# EAGLE design 2in-2out_1.0d (EAGLE 5.02)
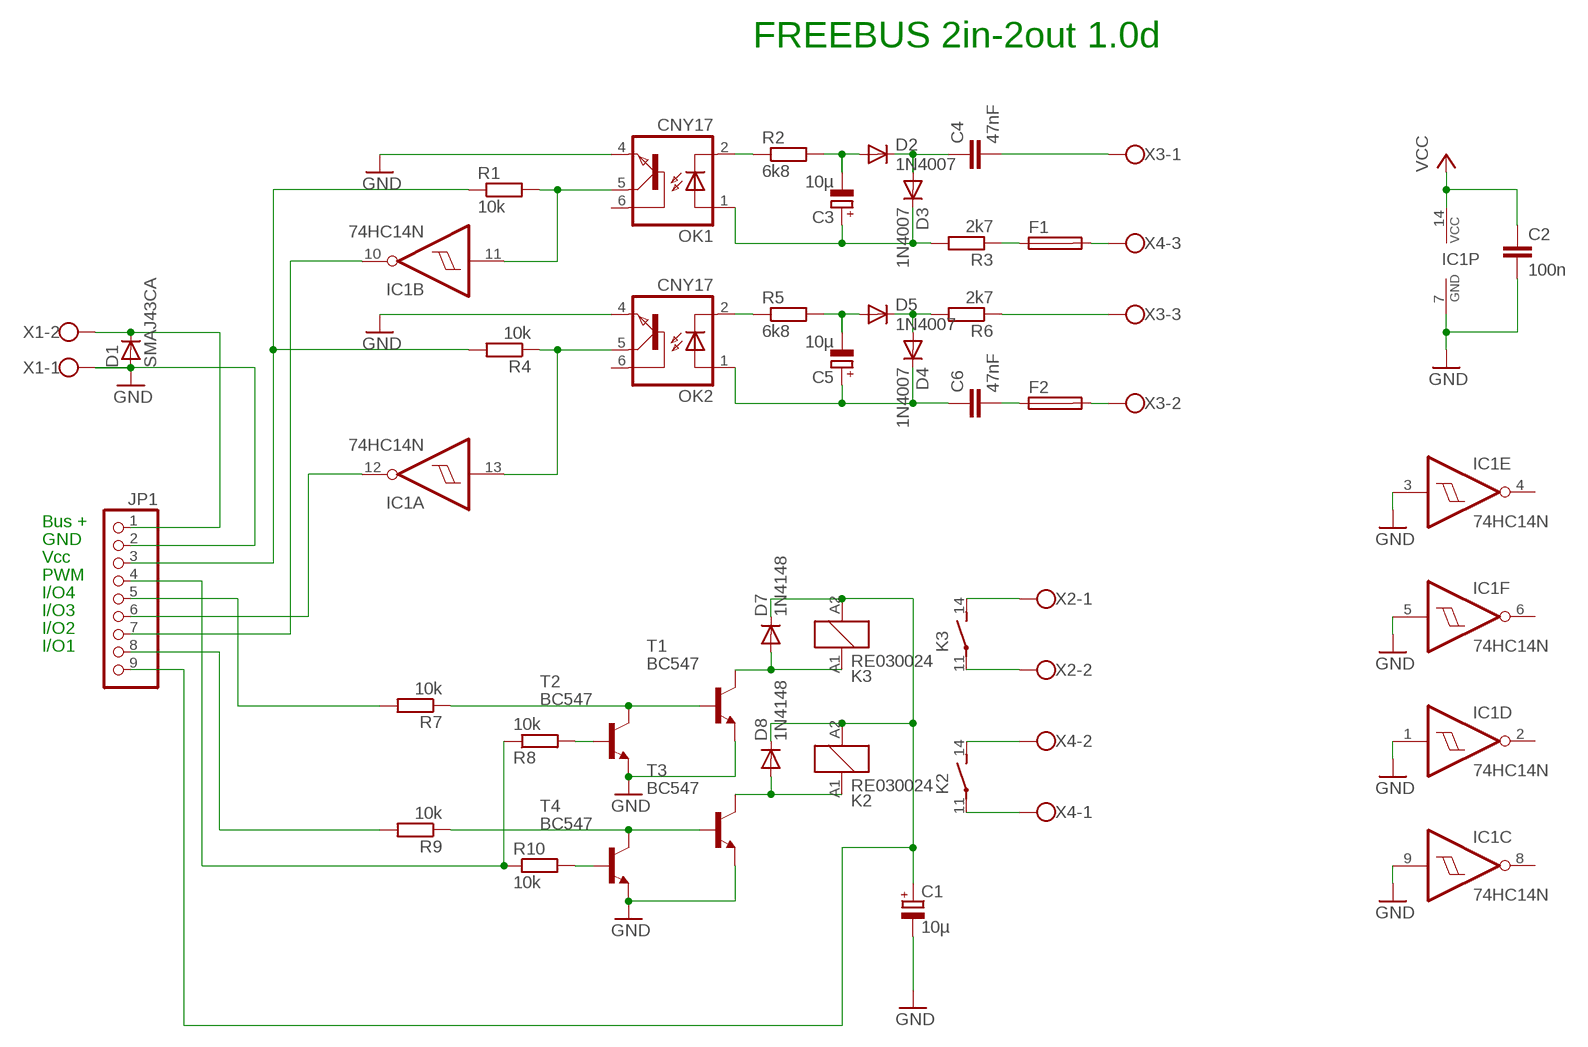
[diagram p0: schematic, sheet 1]

## Parts
C1  10µ  CPOL-EUE3.5-8  [E3,5-8]
C2  100n  C-EU025-024X044  [C025-024X044]
C3  10µ  CPOL-EUE2-4  [E2-4]
C4  47nF  C-EU075-063X106  [C075-063X106]
C5  10µ  CPOL-EUE2-4  [E2-4]
C6  47nF  C-EU075-063X106  [C075-063X106]
D1  SMAJ43CA  D-SMB  [SMB]
D2  1N4007  DIODE-D-2.5  [D-2.5]
D3  1N4007  DIODE-D-2.5  [D-2.5]
D4  1N4007  DIODE-D-2.5  [D-2.5]
D5  1N4007  DIODE-D-2.5  [D-2.5]
D7  1N4148  1N4148STEHEND  [D-2.5]
D8  1N4148  1N4148STEHEND  [D-2.5]
F1  TR5  [TR5]
F2  TR5  [TR5]
IC1  74HC14N  [DIL14]
JP1  PINHD-1X9  [1X09]
K2  RE030024  [RE-SCHRACK]
K3  RE030024  [RE-SCHRACK]
OK1  CNY17  [DIL06]
OK2  CNY17  [DIL06]
R1  10k  R-EU_0207/2V  [0207/2V]
R2  6k8  R-EU_0207/2V  [0207/2V]
R3  2k7  R-EU_0207/2V  [0207/2V]
R4  10k  R-EU_0207/2V  [0207/2V]
R5  6k8  R-EU_0207/2V  [0207/2V]
R6  2k7  R-EU_0207/2V  [0207/2V]
R7  10k  R-EU_0207/2V  [0207/2V]
R8  10k  R-EU_0207/2V  [0207/2V]
R9  10k  R-EU_0207/7  [0207/7]
R10  10k  R-EU_0207/7  [0207/7]
T1  BC547  [TO92]
T2  BC547  [TO92]
T3  BC547  [TO92]
T4  BC547  [TO92]
X1  W237-02P  [W237-132]
X2  W237-02P  [W237-132]
X3  W237-3E  [W237-3E]
X4  W237-3E  [W237-3E]

## Nets
GND: C1.- C2.2 D1.2(A) IC1.1(D:I) IC1.3(E:I) IC1.5(F:I) IC1.7(P:GND) IC1.9(C:I) JP1.2 OK1.4(EMI) OK2.4(EMI) T1.1(E) T2.1(E) T3.1(E) T4.1(E) X1.1
IO1: JP1.8 R9.2
IO2: IC1.10(B:O) JP1.7
IO3: IC1.12(A:O) JP1.6
IO4: JP1.5 R7.2
N$1: OK1.2(C) R2.1
N$2: K3.11(2:P) X2.2
N$3: C3.- D2.A R2.2
N$4: D1.1(C) JP1.1 X1.2
N$5: C4.1 D2.C D3.A
N$6: K3.14(2:S) X2.1
N$7: F1.1 R3.1
N$8: K2.14(2:S) X4.2
N$9: K2.11(2:P) X4.1
N$10: OK2.2(C) R5.1
N$11: R6.1 X3.3
N$12: C4.2 X3.1
N$13: C5.- D5.A R5.2
N$14: R7.1 T1.2(B) T2.3(C)
N$15: F1.2 X4.3
N$17: R9.1 T3.2(B) T4.3(C)
N$18: D4.A D5.C R6.2
N$19: D8.A K2.A1 T3.3(C)
N$20: C5.+ C6.1 D4.C OK2.1(A)
N$21: R8.2 T2.2(B)
N$22: R10.2 T4.2(B)
N$23: C6.2 F2.1
N$24: C3.+ D3.C OK1.1(A) R3.2
N$25: F2.2 X3.2
N$28: IC1.13(A:I) OK2.5(COL) R4.1
N$29: IC1.11(B:I) OK1.5(COL) R1.2
PWM: JP1.4 R8.1 R10.1
R3: D7.A K3.A1 T1.3(C)
VCC: C2.1 IC1.14(P:VCC) JP1.3 R1.1 R4.2
VDD_IN: C1.+ D7.C D8.C JP1.9 K2.A2 K3.A2
Unconnected: IC1.2(D:O) IC1.4(E:O) IC1.6(F:O) IC1.8(C:O) OK1.6(BAS) OK2.6(BAS)

## Notes on the sheet
- FREEBUS 2in-2out 1.0d
- Bus +
- GND
- Vcc
- PWM
- I/O4
- I/O3
- I/O2
- I/O1

## Library data of the parts
C1 C3 C5 = rcl:CPOL-EU: POLARIZED CAPACITOR, European symbol
C2 C4 C6 = rcl:C-EU: CAPACITOR, European symbol
D1 = semicon-smd-ipc:D-: DIODE unfilled
D2-D5 = diode:DIODE-: DIODE
D7 D8 = diode:1N4148: DIODE high speed (Philips)
F1 F2 = fuse:TR5: FUSE Wickmann
IC1 = 74xx-eu:74*14: Hex schmitt trigger INVERTER
JP1 = pinhead:PINHD-1X9: PIN HEADER
K2 K3 = relay:RE03*: Miniature PCB Relay 1 pole 6 A SCHRACK Source: http://www.schrack.com/.. 5812.pdf
OK1 OK2 = optocoupler:CNY17: SIEMENS OPTO COUPLER
R1-R10 = rcl:R-EU_: RESISTOR, European symbol
T1-T4 = transistor-npn:BC547*: NPN Transistor
X1 X2 = con-wago-508:W237-02P: WAGO SREW CLAMP
X3 X4 = con-wago-508:W237-3E: WAGO SREW CLAMP

## Board
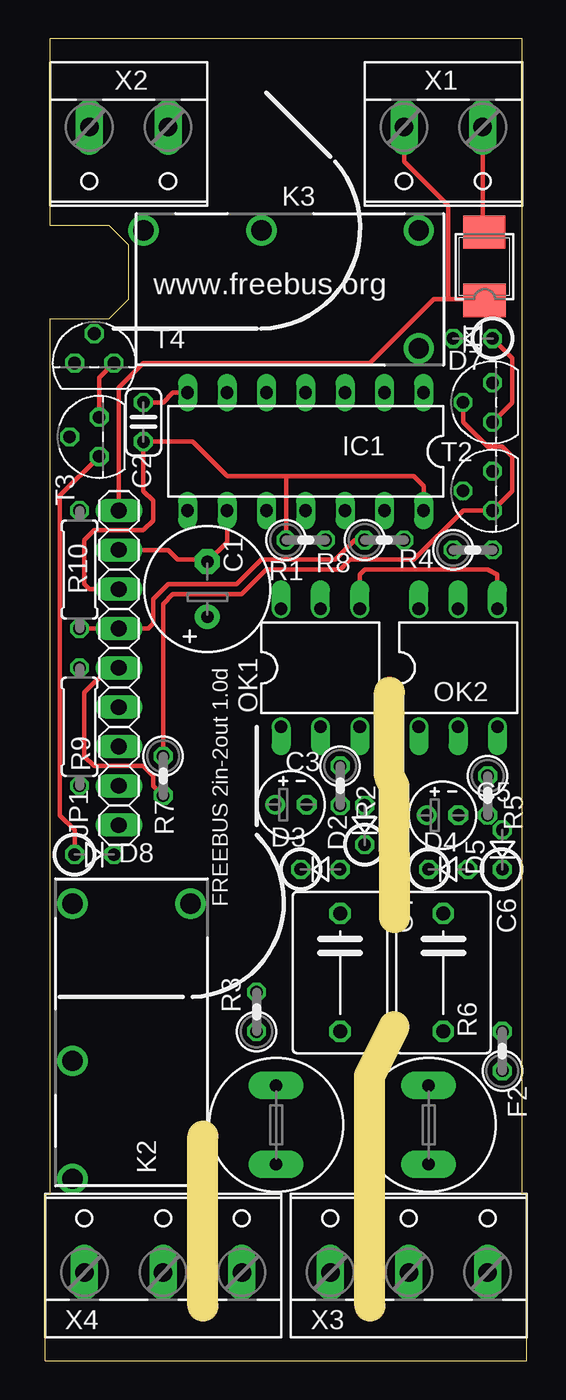
[diagram p1: board, top side]
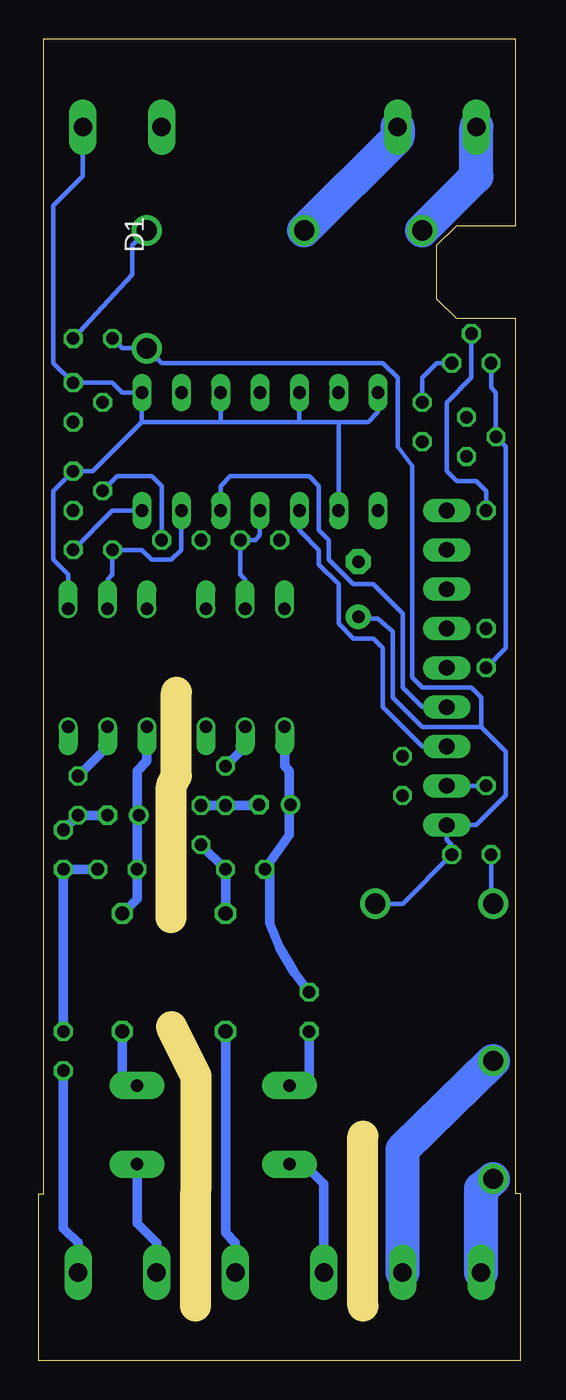
[diagram p2: board, bottom side, seen from below]

Size 31.11 x 85.41 mm. Coordinates in mm from the lower left corner, seen from the top.
Outline: 0,0 0,10.79 0.32,10.79 0.32,67.31 4.13,67.31 5.4,68.58 5.4,72.07 4.13,73.34 0.32,73.34 0.32,85.41 30.8,85.41 30.8,10.79 31.11,10.79 31.11,0 0,0
Copper layers (1*16): Top 0.035mm / dielectric 1.5mm / Bottom 0.035mm
Design rules "ZWILLING": minimum track width 0.2mm, minimum drill 0.5mm, track to track 0.2mm, track to pad 0.2mm, pad to pad 0.2mm, via to via 0.2mm, smd to smd 0mil, copper to edge 0.2mm, drill to drill 0.2mm, minimum pad ring 0.2mm, minimum via ring 0.2mm, stop-mask expansion 0.1mm, vias tented up to drill 0mil, thermal gap 10mil
Milling: 6 lines

### Footprints (pad centres in the part's own frame; a part is rotated, then mirrored left to right if it is on the bottom)
E3,5-8 = drill 0.813 pad 1.6 round: + -1.778,0 | drill 0.813 pad 1.6 octagon: - 1.778,0
C025-024X044 = drill 0.813 octagon: 1 -1.27,0; 2 1.27,0
E2-4 = drill 0.813 pad 1.27 round: + -1.016,0 | drill 0.813 pad 1.27 octagon: - 1.016,0
C075-063X106 = drill 0.914 octagon: 1 -3.81,0; 2 3.81,0
SMB = smd 2.159 x 2.743: 1 -2.311,-0.127; 2 2.108,-0.102
D-2.5 = drill 0.813 octagon: A 1.27,0; C -1.27,0
TR5 = drill 0.813 pad 1.778 long: 1 -2.54,0; 2 2.54,0
DIL14 = drill 0.813 long: 1 -7.62,-3.81; 2 -5.08,-3.81; 3 -2.54,-3.81; 4 0,-3.81; 5 2.54,-3.81; 6 5.08,-3.81; 7 7.62,-3.81; 8 7.62,3.81; 9 5.08,3.81; 10 2.54,3.81; 11 0,3.81; 12 -2.54,3.81; 13 -5.08,3.81; 14 -7.62,3.81
1X09 = drill 1.016 long: 1 -10.16,0; 2 -7.62,0; 3 -5.08,0; 4 -2.54,0; 5 0,0; 6 2.54,0; 7 5.08,0; 8 7.62,0; 9 10.16,0
RE-SCHRACK = drill 1.3 round: 11 8.89,-3.81; 14 1.27,-3.81; A1 -8.89,-3.81; A2 -8.89,3.81
DIL06 = drill 0.813 offset: 1 -2.54,-3.81; 2 0,-3.81; 3 2.54,-3.81; 4 2.54,3.81; 5 0,3.81; 6 -2.54,3.81
0207/2V = drill 0.813 octagon: 1 -1.27,0; 2 1.27,0
0207/7 = drill 0.813 octagon: 1 -3.81,0; 2 3.81,0
TO92 = drill 0.813 octagon: 1 1.27,0; 2 0,1.905; 3 -1.27,0
W237-132 = drill 1.194 long: 1 -2.54,-0.635; 2 2.54,-0.635
W237-3E = drill 1.194 long: 1 -5.08,-0.635; 2 0,-0.635; 3 5.08,-0.635

### Placement (x,y rotation side)
C1  10.48,49.85 90 top
C2  6.35,60.64 90 top
C3  15.88,35.93 0 top
C4  19.05,25.08 270 top
C5  25.67,35.24 0 top
C6  25.72,25.08 270 top
D1  28.26,70.8 90 top
D2  20.64,34.61 90 top
D3  17.78,31.75 0 top
D4  26.04,31.75 0 top
D5  29.53,33.02 90 top
D7  27.62,66.04 0 top
D8  3.17,32.7 180 top
F1  14.92,15.24 270 top
F2  24.77,15.24 270 top
IC1  16.83,58.74 180 top
JP1  4.76,44.77 270 top
K2  5.58,20.64 270 top
K3  15.24,69.22 180 top
OK1  17.78,44.77 0 top
OK2  26.67,44.77 0 top
R1  16.83,53.02 0 top
R2  19.05,37.15 270 top
R3  13.65,22.54 90 top
R4  27.62,52.39 0 top
R5  28.57,36.51 270 top
R6  29.53,20 90 top
R7  7.62,37.78 270 top
R8  21.91,53.02 0 top
R9  2.22,40.96 270 top
R10  2.22,51.12 90 top
T1  28.89,61.91 90 top
T2  28.89,56.2 90 top
T3  3.49,59.69 90 top
T4  3.17,64.45 0 top
X1  25.72,79.06 180 top
X2  5.4,79.06 180 top
X3  23.49,6.35 0 top
X4  7.62,6.35 0 top

### Tracks (layer width: path | path; a pad name or v marks a point on that pad's centre or on a via)
GND
  Top 0.305: 28.26,72.91 28.26,72.71 | 28.26,72.91 D1.2 | X1.1 28.26,72.91 | T3.1 3.49,63.5 T4.1 | C2.2 7.62,61.91 8.26,62.55 IC1.7 | JP1.2 7.94,52.39 8.57,51.75 10.48,51.75 C1.- 11.75,52.9 IC1.9 | OK2.4 29.21,50.8 28.58,51.12 20.64,51.12 20.32,50.8 OK1.4
  Bottom 0.305: 24.45,60.64 27.62,57.47 T2.1 30.16,56.2 30.16,51.75 29.21,50.8 OK2.4 | 19.37,60.64 24.45,60.64 | 19.37,60.64 IC1.3 | 14.29,60.64 19.37,60.64 | 14.29,60.64 IC1.5 | 11.75,60.64 14.29,60.64 | 11.75,60.64 9.84,60.64 9.21,61.28 IC1.7 | IC1.9 11.75,60.64 | X1.1 28.26,76.52 30.16,74.61 30.16,64.45 T1.1 26.35,63.18 25.72,62.55 IC1.1 24.45,60.64 | C2.2 6.35,63.5 5.4,64.45 T4.1
IO1
  Bottom 0.305: R9.2 JP1.8
IO2
  Bottom 0.305: JP1.7 6.35,39.69 8.89,42.23 8.89,46.04 9.52,46.67 10.79,46.67 11.75,47.62 11.75,50.16 13.02,51.44 13.02,52.39 14.29,53.66 IC1.10
IO3
  Bottom 0.305: JP1.6 6.35,42.23 7.62,43.5 7.62,48.26 9.52,50.16 10.79,50.16 12.38,51.75 12.38,53.02 13.02,53.66 13.02,56.52 13.65,57.15 18.73,57.15 19.37,56.52 IC1.12
IO4
  Top 0.305: R7.2 6.99,37.15 6.99,37.78 6.35,38.42 3.17,38.42 2.54,39.05 2.54,43.18 4.13,44.77 JP1.5
N$1
  Bottom 0.61: R2.1 17.78,39.69 OK1.2
N$2
  Bottom 2.184: K3.11 2.86,76.52 X2.2
N$3
  Bottom 0.61: D2.A R2.2 16.83,35.88 16.83,35.93 C3.-
N$4
  Top 0.305: X1.2 23.18,77.47 26.04,74.61 26.04,68.58 | D1.1 28.58,68.49 28.58,68.58 26.04,68.58 | 26.04,68.58 25.08,68.58 20.95,64.45 6.35,64.45 4.76,62.87 JP1.1
N$5
  Bottom 0.61: C4.1 D3.A D2.C
N$6
  Bottom 2.184: K3.14 7.94,79.06 X2.1
N$7
  Bottom 0.61: F1.1 13.65,17.78 R3.1
N$8
  Bottom 2.184: K2.14 7.62,13.65 X4.2
N$9
  Bottom 2.184: K2.11 2.54,11.11 X4.1
N$10
  Bottom 0.61: R5.1 26.67,39.69 OK2.2
N$11
  Bottom 0.61: X3.3 28.58,7.62 29.53,8.57 R6.1
N$12
  Bottom 0.61: X3.1 18.42,7.62 19.05,8.26 C4.2
N$13
  Bottom 0.61: C5.- R5.2 D5.A
N$14
  Top 0.305: T1.2 26.99,60.64 28.58,59.05 29.53,59.05 30.16,58.42 30.16,56.2 T2.3 26.99,54.93 23.81,51.75 19.68,51.75 19.05,51.12 14.29,51.12 12.7,49.53 8.26,49.53 7.62,48.9 R7.1
N$15
  Bottom 0.61: X4.3 12.7,11.43 13.97,12.7 F1.2
N$17
  Bottom 0.305: T4.3 1.9,62.87 1.59,62.55 T3.2 0.95,59.05 0.95,46.04 R9.1
N$18
  Bottom 0.61: D4.A D5.C R6.2
N$19
  Top 0.305: D8.A 1.9,34.29 0.95,35.24 0.95,55.88 T3.3
  Bottom 0.305: K2.A1 1.9,29.53 D8.A
N$20
  Bottom 0.61: C6.1 24.77,29.84 D4.C 24.77,35.24 | 24.77,35.24 C5.+ | 24.77,35.24 24.77,38.1 24.13,38.73 OK2.1
N$21
  Bottom 0.305: T2.2 26.04,57.15 23.81,57.15 23.18,56.52 R8.2
N$22
  Bottom 0.305: R10.2 2.22,56.2 2.86,56.83 4.13,56.83 4.76,57.47 4.76,61.91 3.17,63.5 T4.2
N$23
  Bottom 0.61: F2.1 25.72,17.78 C6.2
N$24
  Bottom 0.61: 14.92,35.61 14.92,38.1 15.24,38.42 OK1.1 | 14.92,35.61 C3.+ | 14.92,35.61 14.92,33.97 D3.C 16.19,31.43 16.19,28.26 15.56,26.67 14.6,25.08 R3.2
N$25
  Bottom 0.61: X3.2 23.49,7.62 24.77,8.89 F2.2
N$28
  Bottom 0.305: IC1.13 21.91,52.39 22.54,51.75 23.81,51.75 24.45,52.39 R4.1 26.35,50.8 26.67,50.48 OK2.5
N$29
  Bottom 0.305: OK1.5 17.78,50.48 18.1,50.8 R1.2 17.15,53.02 16.83,53.34 IC1.11
PWM
  Top 0.305: R10.1 JP1.4 6.67,47.31 6.99,47.62 6.99,49.21 7.94,50.16 12.38,50.16 13.97,51.75 18.73,51.75 20,53.02 R8.1
R3
  Top 0.305: D7.A 30.16,64.77 30.16,61.91 T1.3
  Bottom 0.305: D7.A 25.08,70.17 25.08,72.07 K3.A1
VCC
  Top 0.305: JP1.3 2.86,49.85 2.54,50.16 2.54,53.02 3.17,53.66 6.35,53.66 6.99,54.29 6.99,55.56 6.35,56.2 C2.1 9.52,59.37 11.75,57.15 15.56,57.15 | IC1.14 24.45,56.52 23.81,57.15 15.56,57.15 | 15.56,57.15 R1.1
  Bottom 0.305: R4.2 26.35,54.93 IC1.14
VDD_IN
  Bottom 0.305: D7.C 25.72,65.41 K3.A2 23.18,64.45 8.89,64.45 7.94,63.5 7.94,59.05 6.99,57.79 6.99,44.13 6.35,43.5 3.17,43.5 2.54,42.86 2.54,40.96 | K2.A2 7.62,29.53 D8.C 4.45,33.34 4.76,33.66 JP1.9 2.86,34.61 0.95,36.51 0.95,39.37 2.54,40.96 | C1.+ 10.48,47.94 9.21,47.94 8.26,47.12 8.26,42.86 6.35,40.96 2.54,40.96

### Text on the board
tNames: www.freebus.org | FREEBUS 2in-2out 1.0d